# Altium schematic sheet DAC_DAC084S085_SPI.SchDoc: DAC084S085 8-bit DAC IC
size A4; DocumentNumber: 53; SheetNumber: 54; SheetTotal: 77
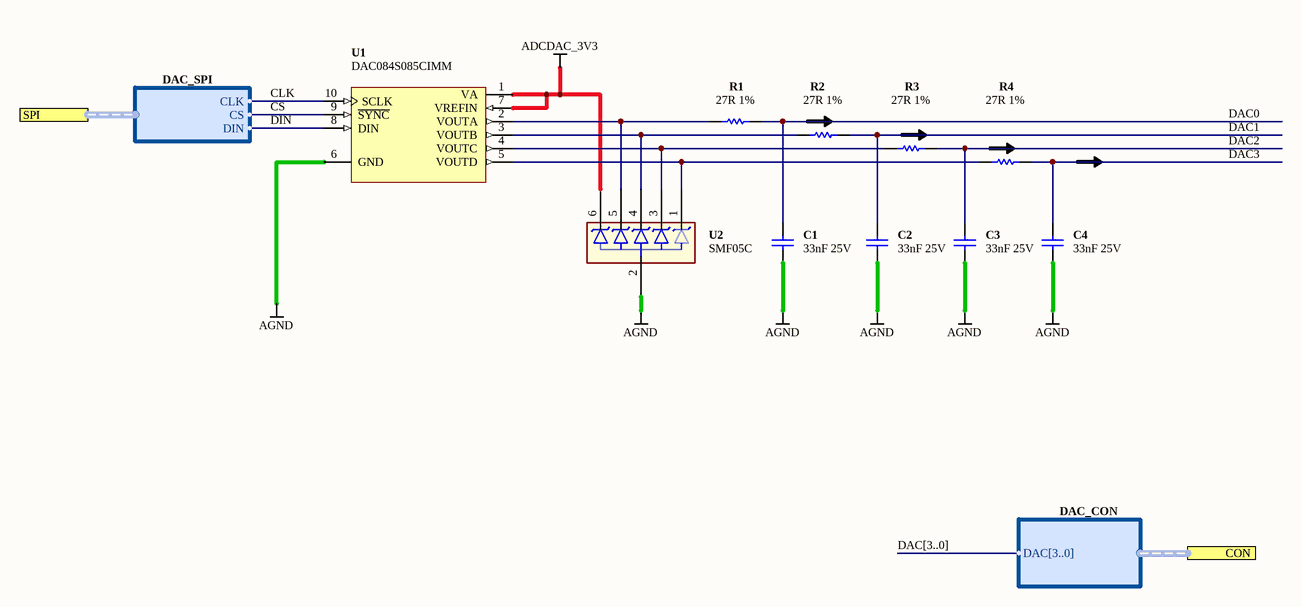
[diagram p0: DAC_DAC084S085_SPI.SchDoc]

## Parts
C1  33nF 25V  [CAPC1005-STAR]
C2  33nF 25V  [CAPC1005-STAR]
C3  33nF 25V  [CAPC1005-STAR]
C4  33nF 25V  [CAPC1005-STAR]
R1  27R 1%  [RESC1005-STAR]
R2  27R 1%  [RESC1005-STAR]
R3  27R 1%  [RESC1005-STAR]
R4  27R 1%  [RESC1005-STAR]
U1  DAC084S085CIMM  [TSSOP50P490-10AN]
U2  SMF05C  [SC70_6L]

## Ports
CON (harness DAC_CON), SPI (harness DAC_SPI)

## Harnesses
DAC_SPI: CS, CLK, DIN
DAC_CON: DAC[3..0]

## Nets
ADCDAC_3V3: U1.1(VA) U1.7(VREFIN) U2.6
AGND: C1.2 C2.2 C3.2 C4.2 U1.6(GND) U2.2
CLK: U1.10(SCLK) ; port SPI.CLK
CS: U1.9(~{SYNC}) ; port SPI.CS
DAC0: C1.1 R1.1
DAC1: C2.1 R2.1
DAC2: C3.1 R3.1
DAC3: C4.1 R4.1
DIN: U1.8(DIN) ; port SPI.DIN
NetR1_2: R1.2 U1.2(VOUTA) U2.5
NetR2_2: R2.2 U1.3(VOUTB) U2.4
NetR3_2: R3.2 U1.4(VOUTC) U2.3
NetR4_2: R4.2 U1.5(VOUTD) U2.1

## Buses and harness runs
bus DAC[3..0]

## Notes on the sheet
- Sheet Title
- Project Title
- Size:
- Date:
- A4
- Assy:
- Time:
- Revision:
- Sheet
- of
- File:

## Library data of the parts
C1-C4 = D-101-0133: Capacitor, Ceramic, 33nF 10% 25V 0402 (1005) X7R; Polarity: Non-Polarized; Category: Capacitor; Capacitance: 33 nF; Dielectric: X7R; Mounting Technology: Surface Mount; Rated Voltage: 25 V; Status: Production; Technology: Ceramic; Tolerance: 10 %
R1-R4 = D-100-0108: Resistor, 27R 1% 0402 (1005); Power Rating: 63 mW; Category: Resistor; Mounting Technology: Surface Mount; Resistance: 27 R; Status: Production; Tolerance: 1 %
U1 = D-222-0004: DAC084S085CIMM, Quad 8-bit, Single 2.7V to 5.5V rail-to-rail output; Bit Width: 8 Bits; Digital Interface: SPI; Max Sample Frequency: 3 us Settling Time Hz; Supply Voltage: 2.7V to 5.5V mV; Mounting Technology: Surface Mount; Status: Unreleased; Temperature Range: -40 to +105 degC; Category: IC-DAC
U2 = D-157-0000: TVS Diode Array  For ESD and Latch-Up Protection; Junction Capacitance: 130 pF; Peak Pulse Current: 8 A; Peak Pulse Power: 100 W; Reverse Breakdown Voltage: 6 V; Status: Unreleased; Category: Diode-Protection